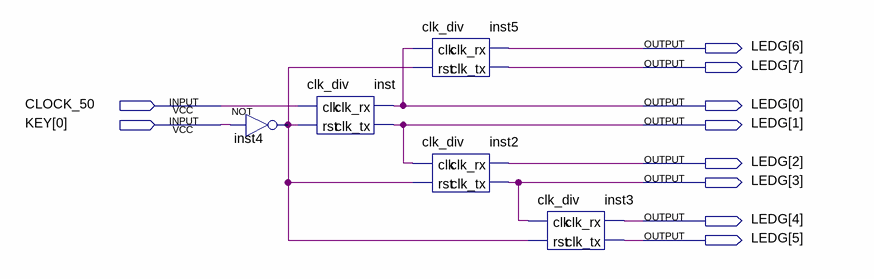
[diagram p0: schematic sheet]
// Quartus schematic clk_div_tester.bdf as structural Verilog: 5 symbols, 10 pins
module clk_div_tester (
  input  CLOCK_50,
  input  [0:0] KEY,
  output [7:0] LEDG
);

  wire inst4_out;

  not inst4 (inst4_out, KEY[0]);
  clk_div inst (.clk(CLOCK_50), .rst(inst4_out), .clk_tx(LEDG[1]), .clk_rx(LEDG[0]));
  clk_div inst5 (.clk(LEDG[0]), .rst(inst4_out), .clk_tx(LEDG[7]), .clk_rx(LEDG[6]));
  clk_div inst2 (.clk(LEDG[1]), .rst(inst4_out), .clk_tx(LEDG[3]), .clk_rx(LEDG[2]));
  clk_div inst3 (.clk(LEDG[3]), .rst(inst4_out), .clk_tx(LEDG[5]), .clk_rx(LEDG[4]));
endmodule
